# Altium schematic sheet USB_to_IRDA.SchDoc
size Tabloid; CompanyName: Motivo Engineering; Address1: 17700 S. Figueroa St.; Address2: Gardena, CA 90248; Address3: United States; SheetNumber: 2; SheetTotal: 2
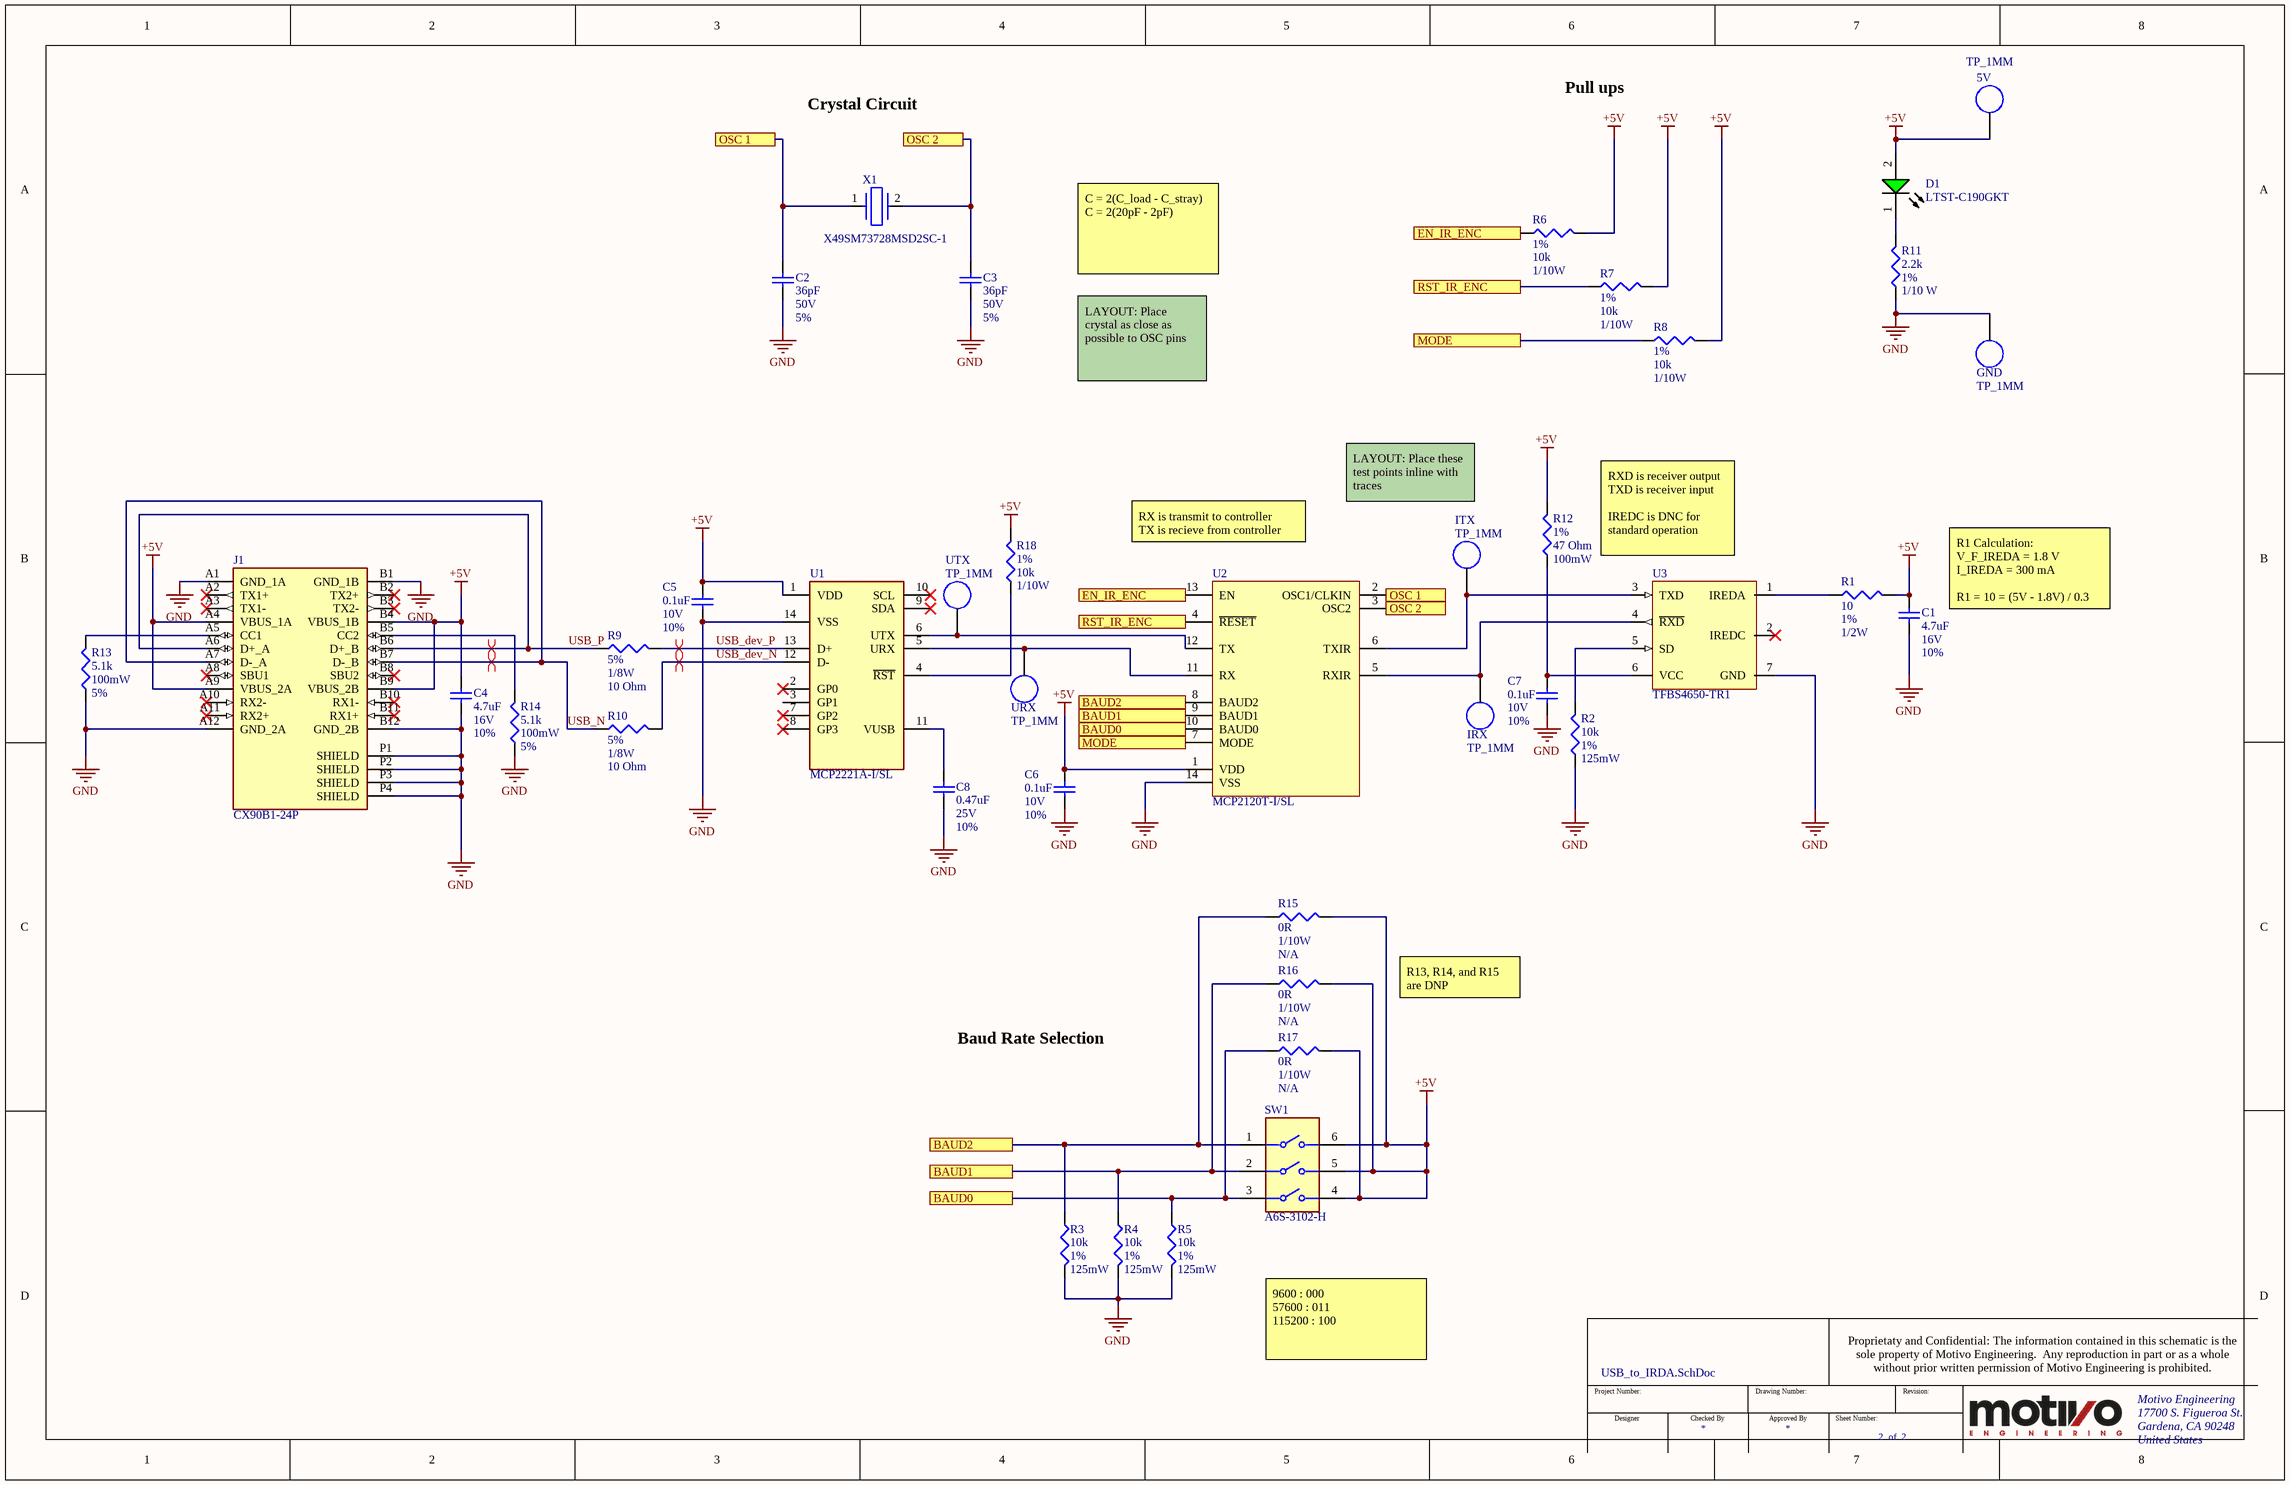
[diagram p0: USB_to_IRDA.SchDoc]

## Parts
5V  TP_1MM  [TP-SM-C-100]  (no BOM)
C1  Capacitance: 4.7uF  Voltage: 16V  Tolerance: 10%  [CAP-0603-MD]  (hidden comment: C1608X5R1C475K080AC)
C2  Capacitance: 36pF  Voltage: 50V  Tolerance: 5%  [CAP-0402-MD]  (hidden comment: CC0402JRNPO9BN360)
C3  Capacitance: 36pF  Voltage: 50V  Tolerance: 5%  [CAP-0402-MD]  (hidden comment: CC0402JRNPO9BN360)
C4  Capacitance: 4.7uF  Voltage: 16V  Tolerance: 10%  [CAP-0603-MD]  (hidden comment: C1608X5R1C475K080AC)
C5  Capacitance: 0.1uF  Voltage: 10V  Tolerance: 10%  [CAP-0603-MD]  (hidden comment: 885012206020)
C6  Capacitance: 0.1uF  Voltage: 10V  Tolerance: 10%  [CAP-0603-MD]  (hidden comment: 885012206020)
C7  Capacitance: 0.1uF  Voltage: 10V  Tolerance: 10%  [CAP-0603-MD]  (hidden comment: 885012206020)
C8  Capacitance: 0.47uF  Voltage: 25V  Tolerance: 10%  [CAP-0603-MD]  (hidden comment: CL10B474KA8VPNC)
D1  LTST-C190GKT  [LED-0603]
GND  TP_1MM  [TP-SM-C-100]  (no BOM)
IRX  TP_1MM  [TP-SM-C-100]  (no BOM)
ITX  TP_1MM  [TP-SM-C-100]  (no BOM)
J1  CX90B1-24P  [HRS_CX90B1-24P]
R1  Resistance: 10  Tolerance: 1%  Power: 1/2W  [RES-1206-MD]  (hidden comment: RNCP1206FTD10R0)
R2  Resistance: 10k  Tolerance: 1%  Power: 125mW  [RES-0805-MD]  (hidden comment: RC0805FR-0710KL)
R3  Resistance: 10k  Tolerance: 1%  Power: 125mW  [RES-0805-MD]  (hidden comment: RC0805FR-0710KL)
R4  Resistance: 10k  Tolerance: 1%  Power: 125mW  [RES-0805-MD]  (hidden comment: RC0805FR-0710KL)
R5  Resistance: 10k  Tolerance: 1%  Power: 125mW  [RES-0805-MD]  (hidden comment: RC0805FR-0710KL)
R6  Tolerance: 1%  Resistance: 10k  Power: 1/10W  [RES-0603-MD]  (hidden comment: RC0603FR-0710KL)
R7  Tolerance: 1%  Resistance: 10k  Power: 1/10W  [RES-0603-MD]  (hidden comment: RC0603FR-0710KL)
R8  Tolerance: 1%  Resistance: 10k  Power: 1/10W  [RES-0603-MD]  (hidden comment: RC0603FR-0710KL)
R9  Tolerance: 5%  Power: 1/8W  Resistance: 10 Ohm  [RES-0805-MD]  (hidden comment: CRCW080510R0JNEA)
R10  Tolerance: 5%  Power: 1/8W  Resistance: 10 Ohm  [RES-0805-MD]  (hidden comment: CRCW080510R0JNEA)
R11  Resistance: 2.2k  Tolerance: 1%  Power: 1/10 W  [RES-0603-MD]  (hidden comment: RC0603FR-072K2L)
R12  Tolerance: 1%  Resistance: 47 Ohm  Power: 100mW  [RES-0603-MD]  (hidden comment: RMCF0603FT47R0)
R13  Resistance: 5.1k  Power: 100mW  Tolerance: 5%  [RES-0603-MD]  (hidden comment: CRCW06035K10JNEA)
R14  Resistance: 5.1k  Power: 100mW  Tolerance: 5%  [RES-0603-MD]  (hidden comment: CRCW06035K10JNEA)
R15  Resistance: 0R  Power: 1/10W  [RES-0603-MD]  (hidden comment: MCR03ERTJ000)
R16  Resistance: 0R  Power: 1/10W  [RES-0603-MD]  (hidden comment: MCR03ERTJ000)
R17  Resistance: 0R  Power: 1/10W  [RES-0603-MD]  (hidden comment: MCR03ERTJ000)
R18  Tolerance: 1%  Resistance: 10k  Power: 1/10W  [RES-0603-MD]  (hidden comment: RC0603FR-0710KL)
SW1  A6S-3102-H  [FP-A6S-3102-H-MFG]
U1  MCP2221A-I/SL  [SOIC127P600X175-14N]
U2  MCP2120T-I/SL  [SOIC127P600X175-14N]
U3  TFBS4650-TR1  [TFBS4650-TR1-Footprint-1]
URX  TP_1MM  [TP-SM-C-100]  (no BOM)
UTX  TP_1MM  [TP-SM-C-100]  (no BOM)
X1  X49SM73728MSD2SC-1  [X49SM73728MSD2SC-1-Footprint-1]

## Ports
BAUD0, BAUD1, BAUD2, EN_IR_ENC, MODE, OSC 1, OSC 2, RST_IR_ENC

## Nets
+5V: 5V.1 C1.2 C4.2 C5.1 C6.1 D1.2(A) J1.A4(VBUS_1A) J1.A9(VBUS_2A) J1.B4(VBUS_1B) J1.B9(VBUS_2B) R1.2 R6.2 R7.2 R8.2 R12.2 R15.2 R16.2 R17.2 R18.2 SW1.4 SW1.5 SW1.6 U1.1(VDD) U2.1(VDD)
GND: C1.1 C2.1 C3.2 C4.1 C5.2 C6.2 C7.2 C8.1 GND.1 J1.A1(GND_1A) J1.A12(GND_2A) J1.B1(GND_1B) J1.B12(GND_2B) J1.P1(SHIELD) J1.P2(SHIELD) J1.P3(SHIELD) J1.P4(SHIELD) R2.1 R3.2 R4.2 R5.2 R11.1 R13.1 R14.1 U1.14(VSS) U2.14(VSS) U3.7(GND)
BAUD0: R5.1 R17.1 SW1.3 U2.10(BAUD0) ; port BAUD0
BAUD1: R4.1 R16.1 SW1.2 U2.9(BAUD1) ; port BAUD1
BAUD2: R3.1 R15.1 SW1.1 U2.8(BAUD2) ; port BAUD2
EN_IR_ENC: R6.1 U2.13(EN) ; port EN_IR_ENC
MODE: R8.1 U2.7(MODE) ; port MODE
OSC 1: C2.2 U2.2(OSC1/CLKIN) X1.1 ; port OSC 1
OSC 2: C3.1 U2.3(OSC2) X1.2 ; port OSC 2
RST_IR_ENC: R7.1 U2.4(~{RESET}) ; port RST_IR_ENC
USB_dev_N: R10.2 U1.12(D-)
USB_dev_P: R9.2 U1.13(D+)
USB_N: J1.A7(D-_A) J1.B7(D-_B) R10.1
USB_P: J1.A6(D+_A) J1.B6(D+_B) R9.1
NetC7_1: C7.1 R12.1 U3.6(VCC)
NetC8_2: C8.2 U1.11(VUSB)
NetD1_1: D1.1(K) R11.2
NetIRX_1: IRX.1 U2.5(RXIR) U3.4(~{RXD})
NetITX_1: ITX.1 U2.6(TXIR) U3.3(TXD)
NetJ1_A5: J1.A5(CC1) R13.2
NetJ1_B5: J1.B5(CC2) R14.2
NetR1_1: R1.1 U3.1(IREDA)
NetR2_2: R2.2 U3.5(SD)
NetR18_1: R18.1 U1.4(~{RST})
NetU1_5: U1.5(URX) U2.11(RX) URX.1
NetU1_6: U1.6(UTX) U2.12(TX) UTX.1

Not connected (* = marked no-connect by the designer): J1 A2(TX1+)* A3(TX1-)* A8(SBU1)* A10(RX2-)* A11(RX2+)* B2(TX2+)* B3(TX2-)* B8(SBU2)* B10(RX1-)* B11(RX1+)*; U1 2(GP0)* 3(GP1) 7(GP2)* 8(GP3)* 9(SDA)* 10(SCL)*; U3 2(IREDC)*

## Layout directives
differential pair; differential pair class USB: USB_dev_N, USB_P
differential pair: USB_dev_P, USB_N

## Notes on the sheet
- Pull ups
- Crystal Circuit
- C = 2(C_load - C_stray)
  C = 2(20pF - 2pF)
- LAYOUT: Place crystal as close as possible to OSC pins
- LAYOUT: Place these test points inline with traces
- RX is transmit to controller
  TX is recieve from controller
- RXD is receiver output
  TXD is receiver input
  IREDC is DNC for standard operation
- (near C1) R1 Calculation:
  V_F_IREDA = 1.8 V
  I_IREDA = 300 mA
  R1 = 10 = (5V - 1.8V) / 0.3
- R13, R14, and R15 are DNP
- Baud Rate Selection
- 9600 : 000
  57600 : 011
  115200 : 100
- Proprietaty and Confidential: The information contained in this schematic is the sole property of Motivo Engineering.  Any reproduction in part or as a whole without prior written permission of Motivo Engineering is prohibited.
- Project Number:
- Designer
- Checked By
- Drawing Number:
- Approved By
- Sheet Number:
- Revision:

## Library data of the parts
5V GND IRX ITX URX UTX = CMP-084-000000-1: Test Point 1MM; CheckedBy: David Volovskiy; CheckedDate: 2/7/2020; CreatedBy: Andrew Ameri; Pin Count: 1; ManufacturerPartNumber: TP_1MM; CreatedDate: 2/1/2020
C1 C4 = CMP-009-000081-8: CAP CER 4.7UF 16V X5R 0603; Manufacturer: TDK; Dielectric: X5R; CheckedDate: 4/4/2018; Case Code (Metric): 1608; Case Code (Imperial): 0603; Case/Package: 0603; CheckedBy: Daniel Samarin; CreatedDate: 5/10/2018
C2 C3 = CMP-002-00422-4: CAP CER 36PF ±5% 50V C0G/NPO 0402; Dielectric: NP0; ManufacturerPartNumber: CC0402JRNPO9BN360; Thickness: 0.022inch; Case Code (Imperial): 0402; CheckedBy: AGL; Packaging: Tape and Reel; Length: 0.039inch; Mounting Technology: Surface Mount; CheckedDate: 1/2/2023; Weight: 2.3E-05oz; Termination: SMD/SMT; RoHS Compliant: Yes; Lead Free: Lead Free; Case Code (Metric): 1005; Width: 0.02inch; Case/Package: 0402; Max Operating Temperature: 125°C; Value: 36pF; Package Quantity: 10000; Series: CC; Min Operating Temperature: -55°C
C5-C7 = CMP-009-000024-8: CAP CER 0.1UF 10V X7R 0603; Manufacturer: Wurth Electronics; CreatedDate: 5/2/2018; ComponentLink1URL: https://search.kemet.com/component-edge/download/datasheet/C0603C104K8PAC7867.pdf; Dielectric: X7R; Case Code (Metric): 1608; ComponentLink1Description: Datasheet; Case Code (Imperial): 0603; CheckedDate: 4/4/2018; Case/Package: 0603; CheckedBy: Daniel Samarin
C8 = CMP-009-000137-8: CAP CER 0.47UF 25V X7R 0603; Manufacturer: Samsung Electro-Mechanics; Case Code (Imperial): 0603; Case/Package: 0603; CreatedDate: 12/27/2020; Case Code (Metric): 1608; Dielectric: X7R
D1 = CMP-024-000054-4: LED GREEN CLEAR CHIP SMD; Manufacturer: Lite-On Inc; Wavelength: 565nm; Vforward: 2.1V; Dominant Wavelength: 569nm; CurrentMax: 120mA; Reverse Voltage: 5V; Created_By: Tejaswi Gode; Lens Color: Colorless; Voltage: 2V; Power Rating: 100mW; Test Current: 10mA; Number of LEDs: 1; Forward Current: 30mA; Lens Size: 0.8mm; Viewing Angle: 130°; Lens Style: Flat,Diffused,Colorless,Rectangular,Clear; Luminous Intensity: 6mcd; Radiation Hardening: No; Length: 1.6mm; RoHS Compliant: Yes; Min Operating Temperature: -55°C; ManufacturerPartNumber: LTST-C190GKT; LEDColor: Green; Lens Transparency: Clear; Case Code (Metric): 1608; Case Code (Imperial): 0603; CheckedDate: 2/12/2024; ComponentLink1Description: Datasheet; Case/Package: 0603; Color: Green; Width: 0.8mm; Pin Count: 2; ComponentLink1URL: http://media.digikey.com/pdf/Data%20Sheets/Lite-On%20PDFs/LTST-C190GKT.pdf; Size: 0603; Pins: 2; Depth: 0.8mm; Number of Elements: 1; Power Dissipation: 100mW; Max Operating Temperature: 85°C; Packaging: Tape and Reel; Mounting Technology: Surface Mount; Forward Voltage: 2.1V; CheckedBy: AGL; Created_Date: 9/8/2016; Illumination Color: Green; Lead Free: Lead Free; Height: 0.9mm; Package Quantity: 1; Series: -
J1 = CMP-144-000000-4: CONN RCP USB3.1 TYPEC 24P SMD RA; Gender: Receptacle; Connector Type: USB; Mating Cycles: 10000; Number of Contacts: 24; Number of Ports: 1; Shielding: Shielded; Component Type: Standard; Insulation Color: Black; Packaging: Cut Tape; Contact Plating: Gold; Max Operating Temperature: 85°C; Min Operating Temperature: -30°C; Mounting Technology: Surface Mount,Through Hole,Horizontal; CheckedBy: AGL; Pin Count: 28; Source: CX90B1-24P.SchLib; Termination: Solder; Flammability Rating: UL94 V-0; Design Item ID: CX90B1-24P; RoHS Compliant: Yes; CheckedDate: 2/13/2024; Series: CX
R1 = CMP-049-000331-23: RES 10 OHM 1% 1/2W 1206; Case Code (Imperial): 1206; Case Code (Metric): 3216; Size: 1206; ComponentLink1Description: Datasheet; ComponentLink1URL: https://www.seielect.com/Catalog/SEI-rncp.pdf; Case/Package: 1206; CreatedDate: 10/15/2020; CheckedBy: AGL; CheckedDate: 1/2/2024
R2-R5 = CMP-049-000214-23: RES 10K OHM 1% 1/8W 0805; Temperature Coefficient: 100ppm/°C; Voltage Rating: 150V; Package Quantity: 1; Case Code (Metric): 2012; Case/Package: 0805; Case Code (Imperial): 0805; Min Operating Temperature: -55°C; Series: RC; Height: 0.024inch; Lead Free: Lead Free; Packaging: Tape and Reel; Width: 0.049inch; Technology: THICK FILM; Length: 0.079inch; Max Power Dissipation: 125mW; RoHS Compliant: Yes; Number of Terminations: 2; Termination: SMD/SMT; Construction: Rectangular; Resistor Type: Thick Film; Resistance Tolerance: 1%; Military Standard: Not; Max Operating Temperature: 155°C; Features: Moisture Resistant; Depth: 1.25mm; CheckedBy: AGL; CheckedDate: 1/2/2024
R6-R8 R18 = CMP-049-000171-20: RES SMD 10K OHM 1% 1/10W 0603; CheckedDate: 1/20/2022; CheckedBy: Chris Verdegan; Size: 0603; CreatedDate: 6/11/2017
R9 R10 = CMP-049-000073-22: RES SMD 10 OHM 5% 1/8W 0805; ComponentLink1URL: http://www.vishay.com/docs/20035/dcrcwe3.pdf; Case/Package: 0805; ComponentLink1Description: Datasheet; Case Code (Imperial): 0805; Case Code (Metric): 2012; Size: 0805; CreatedDate: 9/14/2016; CheckedBy: AGL; CheckedDate: 1/2/2024
R11 = CMP-049-000186-20: RES 2.20K OHM 1/10W 1% 0603 SMD; CheckedDate: 6/29/2014; ComponentLink1Description: Datasheet; CreatedDate: 6/4/2014; Size: 0603; CheckedBy: Daniel Samarin; ComponentLink1URL: http://www.yageo.com/documents/recent/PYu-RC0603_51_RoHS_L_4.pdf
R12 = CMP-011-00087-5: RES 47 OHM 1% 1/10W 0603; Voltage Rating: 75V; Temperature Coefficient: 100ppm/°C; Packaging: Tape and Reel; Case Code (Imperial): 0603; Contact Plating: Tin,Matte; Case/Package: 0603; Radiation Hardening: No; RoHS Compliant: Yes; Height: 0.022inch; Number of Terminations: 2; Width: 0.031inch; Features: Automotive AEC-Q200; Min Operating Temperature: -55°C; Max Operating Temperature: 155°C; Mounting Technology: Surface Mount; Case Code (Metric): 1608; Length: 0.061inch; Series: RMCF
R13 R14 = CMP-049-000065-21: RES SMD 5.1K OHM 5% 1/10W 0603; Voltage Rating (DC): 75V; Temperature Coefficient: 200ppm/°C; ComponentLink1URL: http://www.vishay.com/docs/20035/dcrcwe3.pdf; Contact Plating: Tin; Resistor Type: Thick Film; Construction: Rectangular; Lead Free: Lead Free; Min Operating Temperature: -55°C; Case Code (Imperial): 0603; Case/Package: 0603; Ratings: AEC-Q200; Number of Terminations: 2; Features: Automotive AEC-Q200; Width: 0.85mm; Length: 1.55mm; Case Code (Metric): 1608; Pins: 2; Voltage Rating: 75V; Depth: 0.85mm; ComponentLink1Description: Datasheet; Max Power Dissipation: 100mW; Size: 0603; Reach SVHC Compliant: Unknown; Termination: SMD/SMT; Military Standard: Not; Power Rating: 100mW; Series: CRCW; Height: 0.45mm; Package Quantity: 5000; CreatedDate: 9/9/2016; Radiation Hardening: No; Weight: 7.1E-05oz; Packaging: Tape and Reel; Resistance Tolerance: 5%; RoHS Compliant: Yes; Max Operating Temperature: 155°C
R15-R17 = CMP-049-000159-22: RES SMD 0.0OHM JUMPER 1/10W 0603; Voltage Rating (DC): 50V; Max Power Dissipation: 100mW; Length: 0.063inch; CreatedDate: 8/15/2016; RoHS Compliant: Yes; Packaging: Cut Tape; Number of Terminations: 2; Size: 0603; Case Code (Imperial): 0603; Series: MCR; Case/Package: 0603; Width: 0.031inch; Min Operating Temperature: -55°C; Package Quantity: 1; Max Operating Temperature: 155°C; Height: 0.022inch; Tolerance: N/A; Case Code (Metric): 1608; Lead Free: Lead Free
SW1 = CMP-012-00011-2: SWITCH SLIDE DIP SPST 25MA 24V; Actuator Length: 0mm; Mechanical Life: 1000Cycles; Contact Resistance: 200mR; Washable: Yes; Number of Circuits: 3; Actuator Type: Slide (Standard); Contact Current Rating: 25mA; Length: 8.56mm; Mounting Technology: Surface Mount; Depth: 9.8mm; Throw Configuration: SPST; Max Voltage Rating (DC): 24V; Termination: Gull Wing; RoHS Compliant: Yes; Contact Plating: Gold; Max Current Rating: 25mA; Voltage Rating (DC): 24V; CheckedDate: 1/2/2024; Orientation: Straight; Contact Material: Gold; CheckedBy: AGL; Packaging: Rail/Tube; Radiation Hardening: No; Package Quantity: 55; Electrical Life: 1000Cycles; Min Operating Temperature: -20°C; Max Operating Temperature: 70°C; Series: A6S-H; Terminal Pitch: 2.54mm; Reach SVHC Compliant: Unknown; Number of Positions: 3; Case/Package: DIP
U1 = CMP-016-00019-4: IC USB TO I2C/UART 14SOIC; Interface: I2C,UART; Operating Supply Current: 13mA; RoHS Compliant: Yes; Series: -; Case/Package: SOIC; Max Operating Temperature: 85°C; Packaging: Rail/Tube; Min Operating Temperature: -40°C
U2 = CMP-016-00020-5: IC ENCODR/DECODR 2.5V IR 14-SOIC; Touchscreen: Infrared (IR); Max Supply Voltage: 5.5V; Nominal Supply Current: 1.4mA; Number of Bits: 16; Voltage: 5V; Power Dissipation: 700mW; Number of Channels: 1; Packaging: Tape and Reel; Radiation Hardening: No; Package Quantity: 2600; Mounting Technology: Surface Mount; Max Operating Temperature: 85°C; CheckedBy: A.DANG; Min Operating Temperature: -40°C; Lead Free: Lead Free; RoHS Compliant: Yes; Pins: 14; Case/Package: SOIC; Series: -; Min Supply Voltage: 2.5V
U3 = CMP-025-00000-1: TXRX IRDA 115.2KBIT SIDE 7-SMD / Infrared Transceiver 9.6 kbit/s to 115.2 kbit/s (SIR)
X1 = CMP-003-00033-1: 7.3728MHz 20pF ±20ppm HC-49S-SMD Crystals ROHS; Value: 7.3728 MHz; Capacitanace: 20 pF